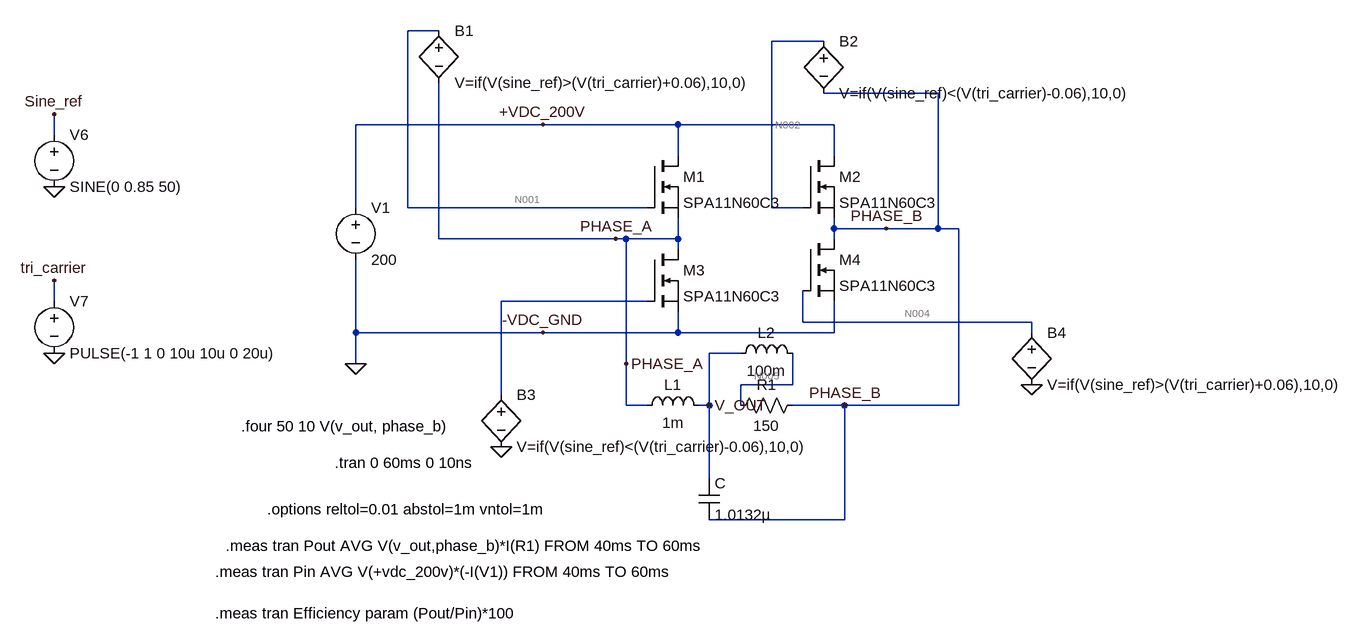
[diagram p0: schematic Draft5.asc]
Draft5.asc, the LTspice schematic file:
Version 4.1
SHEET 1 1284 784
WIRE -176 -128 -224 -128
WIRE 416 -112 336 -112
WIRE 592 -32 416 -32
WIRE -16 16 -304 16
WIRE 192 16 -16 16
WIRE 432 16 192 16
WIRE -768 32 -768 0
WIRE 192 64 192 16
WIRE 432 64 432 16
WIRE -304 144 -304 16
WIRE -224 144 -224 -128
WIRE 144 144 -224 144
WIRE 336 144 336 -112
WIRE 384 144 336 144
WIRE 432 176 432 160
WIRE 512 176 432 176
WIRE 592 176 592 -32
WIRE 592 176 512 176
WIRE 624 176 592 176
WIRE -176 192 -176 -48
WIRE 96 192 -176 192
WIRE 112 192 96 192
WIRE 192 192 192 160
WIRE 192 192 112 192
WIRE 432 192 432 176
WIRE 192 208 192 192
WIRE -768 288 -768 256
WIRE 144 288 -80 288
WIRE 384 320 384 272
WIRE 736 320 384 320
WIRE -304 336 -304 224
WIRE -16 336 -304 336
WIRE 192 336 192 304
WIRE 192 336 -16 336
WIRE 432 336 432 288
WIRE 432 336 192 336
WIRE 736 336 736 320
WIRE 288 368 240 368
WIRE -304 384 -304 336
WIRE 112 384 112 192
WIRE 368 416 368 368
WIRE 368 416 288 416
WIRE -80 432 -80 288
WIRE 112 448 112 384
WIRE 144 448 112 448
WIRE 240 448 240 368
WIRE 240 448 224 448
WIRE 288 448 288 416
WIRE 448 448 368 448
WIRE 624 448 624 176
WIRE 624 448 448 448
WIRE 240 560 240 448
WIRE 448 624 448 448
WIRE 448 624 240 624
FLAG -16 16 +VDC_200V
FLAG -16 336 -VDC_GND
FLAG 512 176 PHASE_B
FLAG 96 192 PHASE_A
FLAG 112 384 PHASE_A
FLAG 448 448 PHASE_B
FLAG -304 384 0
FLAG 736 416 0
FLAG -80 512 0
FLAG 240 448 V_OUT
FLAG -768 0 Sine_ref
FLAG -768 256 tri_carrier
FLAG -768 112 0
FLAG -768 368 0
SYMBOL nmos 144 64 R0
SYMATTR InstName M1
SYMATTR Value SPA11N60C3
SYMBOL nmos 384 64 R0
SYMATTR InstName M2
SYMATTR Value SPA11N60C3
SYMBOL nmos 144 208 R0
SYMATTR InstName M3
SYMATTR Value SPA11N60C3
SYMBOL nmos 384 192 R0
SYMATTR InstName M4
SYMATTR Value SPA11N60C3
SYMBOL voltage -304 128 R0
WINDOW 123 0 0 Left 0
WINDOW 39 0 0 Left 0
SYMATTR InstName V1
SYMATTR Value 200
SYMBOL res 272 464 R270
WINDOW 0 32 56 VTop 2
WINDOW 3 0 56 VBottom 2
SYMATTR InstName R1
SYMATTR Value 150
SYMBOL ind 128 464 R270
WINDOW 0 32 56 VTop 2
WINDOW 3 5 56 VBottom 2
SYMATTR InstName L1
SYMATTR Value 1m
SYMBOL cap 224 560 R0
SYMATTR InstName C
SYMATTR Value 1.0132µ
SYMBOL bv -176 -144 R0
SYMATTR InstName B1
SYMATTR Value V=if(V(sine_ref)>(V(tri_carrier)+0.06),10,0)
SYMBOL bv 416 -128 R0
SYMATTR InstName B2
SYMATTR Value V=if(V(sine_ref)<(V(tri_carrier)-0.06),10,0)
SYMBOL bv -80 416 R0
SYMATTR InstName B3
SYMATTR Value V=if(V(sine_ref)<(V(tri_carrier)-0.06),10,0)
SYMBOL bv 736 320 R0
SYMATTR InstName B4
SYMATTR Value V=if(V(sine_ref)>(V(tri_carrier)+0.06),10,0)
SYMBOL voltage -768 16 R0
WINDOW 123 0 0 Left 0
WINDOW 39 0 0 Left 0
SYMATTR InstName V6
SYMATTR Value SINE(0 0.85 50)
SYMBOL voltage -768 272 R0
WINDOW 123 0 0 Left 0
WINDOW 39 0 0 Left 0
SYMATTR InstName V7
SYMATTR Value PULSE(-1 1 0 10u 10u 0 20u)
SYMBOL ind 272 384 R270
WINDOW 0 32 56 VTop 2
WINDOW 3 5 56 VBottom 2
SYMATTR InstName L2
SYMATTR Value 100m
TEXT -336 536 Left 2 !.tran 0 60ms 0 10ns
TEXT -440 608 Left 2 !.options reltol=0.01 abstol=1m vntol=1m
TEXT -480 480 Left 2 !.four 50 10 V(v_out, phase_b)
TEXT -504 664 Left 2 !.meas tran Pout AVG V(v_out,phase_b)*I(R1) FROM 40ms TO 60ms
TEXT -520 704 Left 2 !.meas tran Pin AVG V(+vdc_200v)*(-I(V1)) FROM 40ms TO 60ms
TEXT -520 768 Left 2 !.meas tran Efficiency param (Pout/Pin)*100

The netlist it stands for:
* Draft5.asc
M1 +VDC_200V N001 PHASE_A PHASE_A SPA11N60C3
M2 +VDC_200V N002 PHASE_B PHASE_B SPA11N60C3
M3 PHASE_A N003 0 0 SPA11N60C3
M4 PHASE_B N004 0 0 SPA11N60C3
V1 +VDC_200V 0 200
R1 N005 PHASE_B 150
L1 PHASE_A V_OUT 1m
C V_OUT PHASE_B 1.0132µ
B1 N001 PHASE_A V=if(V(sine_ref)>(V(tri_carrier)+0.06),10,0)
B2 N002 PHASE_B V=if(V(sine_ref)<(V(tri_carrier)-0.06),10,0)
B3 N003 0 V=if(V(sine_ref)<(V(tri_carrier)-0.06),10,0)
B4 N004 0 V=if(V(sine_ref)>(V(tri_carrier)+0.06),10,0)
V6 Sine_ref 0 SINE(0 0.85 50)
V7 tri_carrier 0 PULSE(-1 1 0 10u 10u 0 20u)
L2 V_OUT N005 100m
.model NMOS NMOS
.model PMOS PMOS
.lib standard.mos
.tran 0 60ms 0 10ns
.options reltol=0.01 abstol=1m vntol=1m
.four 50 10 V(v_out, phase_b)
.meas tran Pout AVG V(v_out,phase_b)*I(R1) FROM 40ms TO 60ms
.meas tran Pin AVG V(+vdc_200v)*(-I(V1)) FROM 40ms TO 60ms
.meas tran Efficiency param (Pout/Pin)*100
.backanno
.end

* Results of the author's LTspice run, read from the files saved beside the schematic
* Operating Point, zero values left out:
*   V(+vdc_200v) = 200 V
*   V(n001) = 209.5 V
*   V(n002) = 451.7 mV
*   V(n004) = 10 V
*   V(n005) = 199.5 V
*   V(phase_a) = 199.5 V
*   V(phase_b) = 451.7 mV
*   V(tri_carrier) = -1 V
*   V(v_out) = 199.5 V
*   I(L1) = 1.327 A
*   I(L2) = 1.327 A
*   I(R1) = 1.327 A
*   I(V1) = -1.327 A
*   Id(M1) = 1.327 A
*   Id(M2) = 219.6 pA
*   Id(M3) = 218.3 pA
*   Id(M4) = 1.327 A
*   Is(M1) = -1.327 A
*   Is(M2) = -219.6 pA
*   Is(M3) = -218.3 pA
*   Is(M4) = -1.327 A
* From the log:
*   Fourier components of V(v_out, phase_b)
*   N-Period=1
*   DC component:-0.00154893
*   Harmonic  Frequency   Fourier   Normalized   Phase    Normalized
*    Number     [Hz]     Component   Component  [degree]  Phase [deg]
*       1      5.000e+01   1.575e+02   1.000e+00     89.68°      0.00°
*       2      1.000e+02   8.227e-04   5.224e-06     77.97°    -11.71°
*       3      1.500e+02   1.550e+00   9.840e-03    105.20°     15.52°
*       4      2.000e+02   4.467e-03   2.836e-05    104.50°     14.82°
*       5      2.500e+02   2.604e+00   1.653e-02    115.53°     25.85°
*       6      3.000e+02   2.891e-03   1.836e-05   -116.35°   -206.03°
*       7      3.500e+02   2.591e-01   1.645e-03    122.55°     32.87°
*       8      4.000e+02   4.049e-03   2.571e-05    -12.02°   -101.70°
*       9      4.500e+02   1.229e+00   7.801e-03    -43.44°   -133.12°
*      10      5.000e+02   1.970e-03   1.251e-05     25.01°    -64.67°
*   Partial Harmonic Distortion: 2.082637%
*   Total Harmonic Distortion:   2.542222%
*   pout: AVG(V(v_out,phase_b)*I(R1))=79.2259636475 FROM 0.04 TO 0.06
*   pin: AVG(V(+vdc_200v)*(-I(V1)))=80.0098889357 FROM 0.04 TO 0.06
*   efficiency: (Pout/Pin)*100=99.0202145027